# Altium schematic sheet TRANSLATOR_8CH.SchDoc: TRANSLATOR 8CH
size A4; Author: Silvio Navaretti; CompanyName: ARDUINO; DrawnBy: Silvio Navaretti; Engineer: Silvio Navaretti; Organization: ARDUINO; SheetNumber: 51; SheetTotal: 51; RevAuthor: Silvio Navaretti
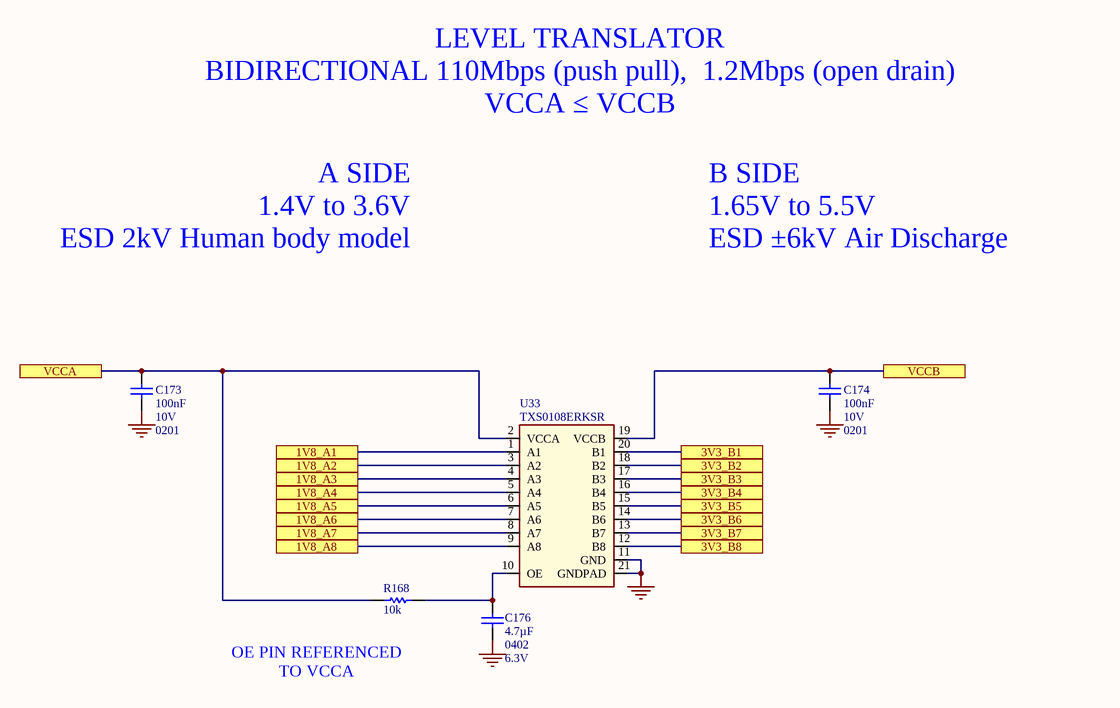
[diagram p0: TRANSLATOR_8CH.SchDoc]

## Parts
C173  value 100nF  Voltage: 10V  Case Code (Imperial): 0201  [CAP-0201]  (hidden comment: CL03A104KP3NNNC)
C174  value 100nF  Voltage: 10V  Case Code (Imperial): 0201  [CAP-0201]  (hidden comment: CL03A104KP3NNNC)
C176  value 4.7µF  Case Code (Imperial): 0402  Voltage: 6.3V  [CAP-0402]  (hidden comment: C1005A475M6R3NT)
R168  value 10k  [RES-0201]  (hidden comment: RC0201FR-0710KL)
U33  TXS0108ERKSR  [QFN50P250X450X100_HS-21N]

## Ports
1V8_A1, 1V8_A2, 1V8_A3, 1V8_A4, 1V8_A5, 1V8_A6, 1V8_A7, 1V8_A8, 3V3_B1, 3V3_B2, 3V3_B3, 3V3_B4, 3V3_B5, 3V3_B6, 3V3_B7, 3V3_B8, VCCA, VCCB

## Nets
GND: C173.1 C174.1 C176.2 U33.11(GND) U33.21(GNDPAD)
1V8_A1: U33.1(A1) ; port 1V8_A1
1V8_A2: U33.3(A2) ; port 1V8_A2
1V8_A3: U33.4(A3) ; port 1V8_A3
1V8_A4: U33.5(A4) ; port 1V8_A4
1V8_A5: U33.6(A5) ; port 1V8_A5
1V8_A6: U33.7(A6) ; port 1V8_A6
1V8_A7: U33.8(A7) ; port 1V8_A7
1V8_A8: U33.9(A8) ; port 1V8_A8
3V3_B1: U33.20(B1) ; port 3V3_B1
3V3_B2: U33.18(B2) ; port 3V3_B2
3V3_B3: U33.17(B3) ; port 3V3_B3
3V3_B4: U33.16(B4) ; port 3V3_B4
3V3_B5: U33.15(B5) ; port 3V3_B5
3V3_B6: U33.14(B6) ; port 3V3_B6
3V3_B7: U33.13(B7) ; port 3V3_B7
3V3_B8: U33.12(B8) ; port 3V3_B8
VCCA: C173.2 R168.2 U33.2(VCCA) ; port VCCA
VCCB: C174.2 U33.19(VCCB) ; port VCCB
NetC176_1: C176.1 R168.1 U33.10(OE)

## Notes on the sheet
- LEVEL TRANSLATOR
  BIDIRECTIONAL 110Mbps (push pull),  1.2Mbps (open drain)
  VCCA ≤ VCCB
- A SIDE
  1.4V to 3.6V
  ESD 2kV Human body model
- B SIDE
  1.65V to 5.5V
  ESD ±6kV Air Discharge
- (near R168) OE PIN REFERENCED TO VCCA
- Title:
- ID:
- Date:
- Time:
- Version:
- Sheet
- of
- RevAuthor:
- Reference Designs ARE PROVIDED "AS IS" AND "WITH ALL FAULTS. Arduino SA DISCLAIMS ALL OTHER WARRANTIES, EXPRESS OR IMPLIED, REGARDING PRODUCTS, INCLUDING BUT NOT LIMITED TO, ANY IMPLIED WARRANTIES OF MERCHANTABILITY OR FITNESS FOR A PARTICULAR PURPOSE.
  Arduino SA may make changes to specifications and product descriptions at any time, without notice. The Customer must not rely on the absence or characteristics of any features or instructions marked "reserved" or "undefined". Arduino SA reserves these for future definition and shall have no responsibility whatsoever for conflicts or incompatibilities arising from future changes to them. The product information on the Web Site or Materials is subject to change without notice.
  Do not finalize a design with this info. ARDUINO and other Arduino brands and logos and Trademarks of Arduino SA. All Arduino SA Trademarks cannot be used without owner's formal permission.
- File:
- Author:

## Library data of the parts
C173 C174 = C0113-A.6: CAP CHIP 0201 100nF 10% 10V X5R; Manufacturer: Samsung Electro-Mechanics; Code Arduino: C0113; Technology: Ceramic; Part Number: CL03A104KP3NNNC; Dielectric: X5R; Tolerance: 10%
C176 = C0037-A.14: CAP CHIP 0402 4.7uF 20% 6V3 X5R; Manufacturer: Hottech; Code Arduino: 0833; Dielectric: X5R; Technology: Ceramic; Part Number: C1005A475M6R3NT; Manufacturer 2: Samsung Electro-Mechanics; Tolerance: 20%; Manufacturer 3: Murata Electronics; Part number 3: GRM155R60J475ME47D; Part number 2: CL05A475KQ5NRNC
R168 = R0145-A.21: RES CHIP 0201 10k 1% 1/20W; Manufacturer: Yageo; Power: 50mW; Temperature coefficient: 200ppm; Code Arduino: R0145; Manufacturer 2: Samsung Electro-Mechanics; Tolerance: 1%; Case Code (Imperial): 0201; Part Number: RC0201FR-0710KL; Technology: Thick film
U33 = U0456-A.4: IC TRANSLATOR LEVEL SHIFTER BIDIR 8b, push pull 110Mbps, open drain 1.2Mbps, VCCA 1.4V-3.6V, VCCB 1.6V-5.5V, VCCA≤VCCB, Output Enable, VQFN-20; Manufacturer: Texas Instruments; Code Arduino: U0456; Part Number: TXS0108ERKSR; LCSC Part #: C43138309